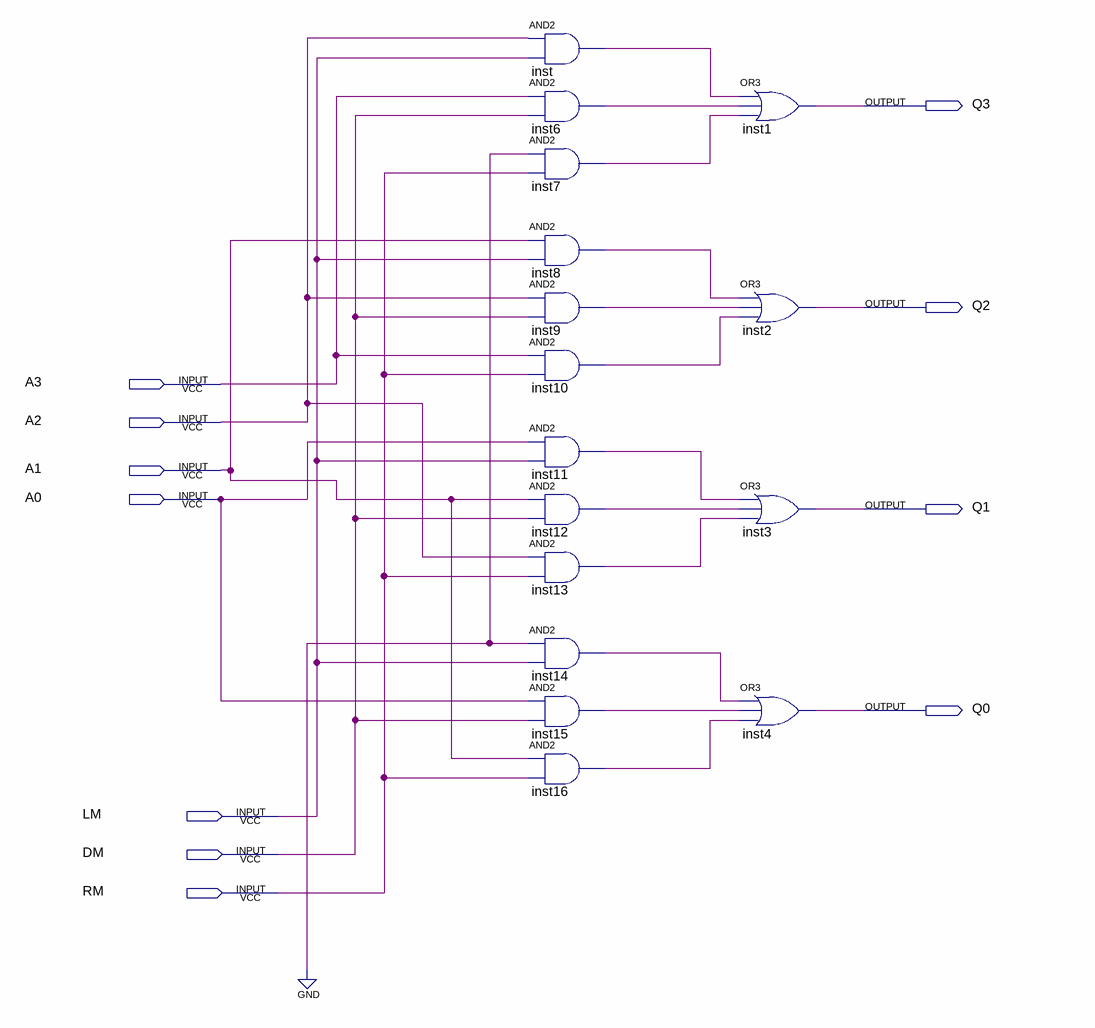
[diagram p0: schematic sheet]
// Quartus schematic Shift-4.bdf as structural Verilog: 16 symbols, 11 pins
module \Shift-4  (
  input  A3,
  input  A2,
  input  A1,
  input  A0,
  input  LM,
  input  DM,
  input  RM,
  output Q3,
  output Q2,
  output Q1,
  output Q0
);

  wire inst6_out, inst7_out, inst8_out, inst9_out, inst10_out, inst11_out, inst12_out, inst13_out,
       inst14_out, inst15_out, inst16_out, inst_out;

  and inst (inst_out, A2, LM);
  and inst6 (inst6_out, A3, DM);
  and inst7 (inst7_out, 1'b0, RM);
  and inst8 (inst8_out, A1, LM);
  and inst9 (inst9_out, A2, DM);
  and inst10 (inst10_out, A3, RM);
  and inst11 (inst11_out, A0, LM);
  and inst12 (inst12_out, A1, DM);
  and inst13 (inst13_out, A2, RM);
  and inst14 (inst14_out, 1'b0, LM);
  and inst15 (inst15_out, A0, DM);
  and inst16 (inst16_out, A1, RM);
  or inst1 (Q3, inst_out, inst6_out, inst7_out);
  or inst2 (Q2, inst8_out, inst9_out, inst10_out);
  or inst3 (Q1, inst11_out, inst12_out, inst13_out);
  or inst4 (Q0, inst14_out, inst15_out, inst16_out);
endmodule
